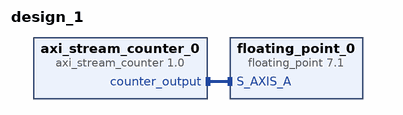
[diagram p0: block diagram of the top level]
# Vivado block design design_1, xc7z010clg400-1, Vivado 2018.3
create_bd_design design_1

create_bd_cell -type ip -vlnv xilinx.com:hls:axi_stream_counter:1.0 axi_stream_counter_0
create_bd_cell -type ip -vlnv xilinx.com:ip:floating_point:7.1 floating_point_0

# ---- connections ----

connect_bd_intf_net [get_bd_intf_pins floating_point_0/S_AXIS_A] [get_bd_intf_pins axi_stream_counter_0/counter_output]

validate_bd_design
save_bd_design
